# EAGLE design working (EAGLE 6.5.0)
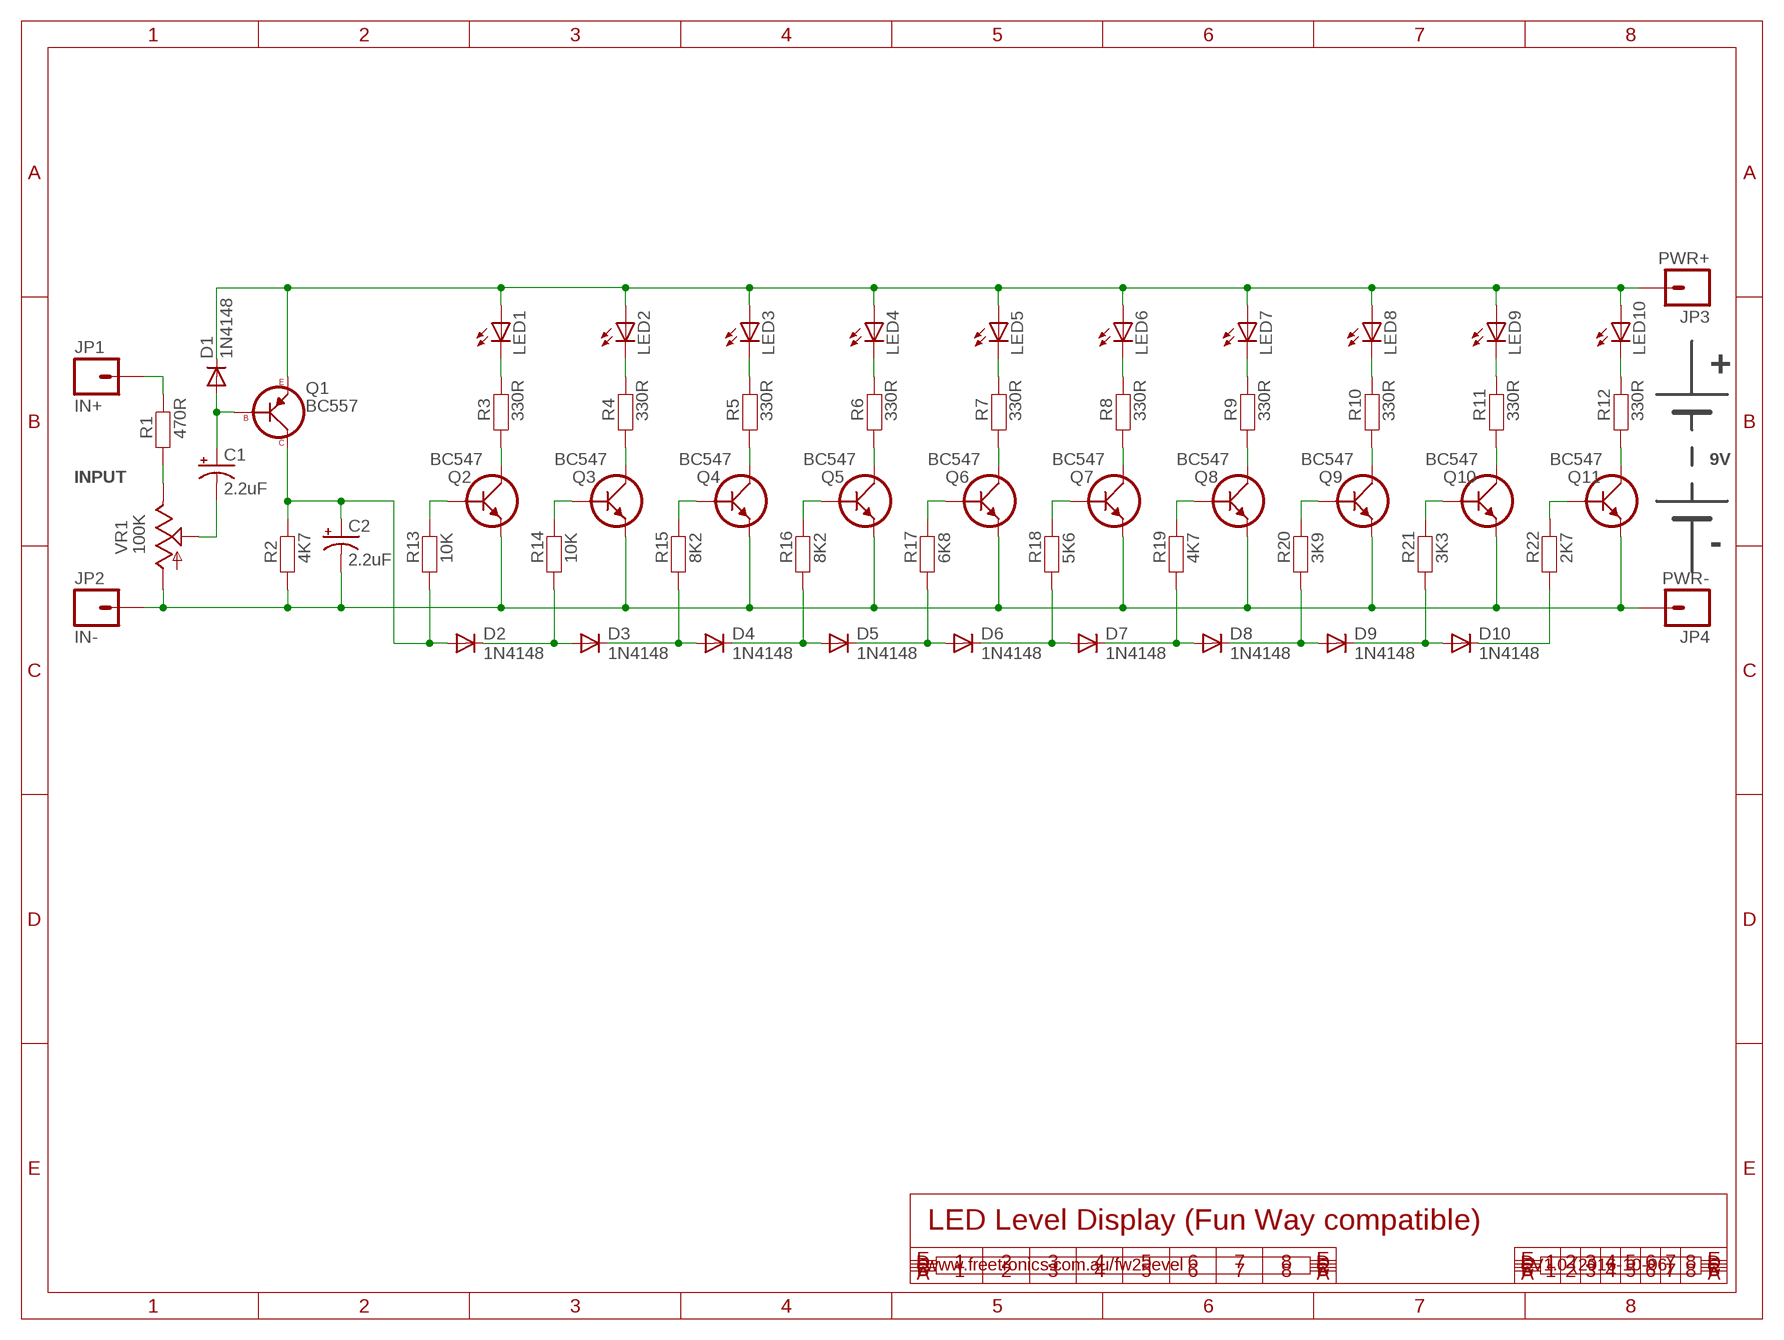
[diagram p0: schematic, sheet 1]

## Parts
C1  2.2uF  CAP_POLPTH1  [CPOL-RADIAL-100UF-25V]
C2  2.2uF  CAP_POLPTH1  [CPOL-RADIAL-100UF-25V]
D1  1N4148  DIODE1N914L  [DIODE-1N914L]
D2  1N4148  DIODE1N914L  [DIODE-1N914L]
D3  1N4148  DIODE1N914L  [DIODE-1N914L]
D4  1N4148  DIODE1N914L  [DIODE-1N914L]
D5  1N4148  DIODE1N914L  [DIODE-1N914L]
D6  1N4148  DIODE1N914L  [DIODE-1N914L]
D7  1N4148  DIODE1N914L  [DIODE-1N914L]
D8  1N4148  DIODE1N914L  [DIODE-1N914L]
D9  1N4148  DIODE1N914L  [DIODE-1N914L]
D10  1N4148  DIODE1N914L  [DIODE-1N914L]
JP1  IN+  M01PTH  [1X01]
JP2  IN-  M01PTH  [1X01]
JP3  PWR+  M01PTH  [1X01]
JP4  PWR-  M01PTH  [1X01]
LED1  LED5MML  [LED5MMLARGE]
LED2  LED5MML  [LED5MMLARGE]
LED3  LED5MML  [LED5MMLARGE]
LED4  LED5MML  [LED5MMLARGE]
LED5  LED5MML  [LED5MMLARGE]
LED6  LED5MML  [LED5MMLARGE]
LED7  LED5MML  [LED5MMLARGE]
LED8  LED5MML  [LED5MMLARGE]
LED9  LED5MML  [LED5MMLARGE]
LED10  LED5MML  [LED5MMLARGE]
Q1  BC557  [TO-92]
Q2  BC547  [TO-92]
Q3  BC547  [TO-92]
Q4  BC547  [TO-92]
Q5  BC547  [TO-92]
Q6  BC547  [TO-92]
Q7  BC547  [TO-92]
Q8  BC547  [TO-92]
Q9  BC547  [TO-92]
Q10  BC547  [TO-92]
Q11  BC547  [TO-92]
R1  470R  FREETRONICS_RESISTORPTH3  [AXIAL-0.4-LARGE]
R2  4K7  FREETRONICS_RESISTORPTH3  [AXIAL-0.4-LARGE]
R3  330R  RESISTORVERT3  [0309VW]
R4  330R  RESISTORVERT3  [0309VW]
R5  330R  RESISTORVERT3  [0309VW]
R6  330R  RESISTORVERT3  [0309VW]
R7  330R  RESISTORVERT3  [0309VW]
R8  330R  RESISTORVERT3  [0309VW]
R9  330R  RESISTORVERT3  [0309VW]
R10  330R  RESISTORVERT3  [0309VW]
R11  330R  RESISTORVERT3  [0309VW]
R12  330R  RESISTORVERT3  [0309VW]
R13  10K  RESISTORVERT3  [0309VW]
R14  10K  RESISTORVERT3  [0309VW]
R15  8K2  RESISTORVERT3  [0309VW]
R16  8K2  RESISTORVERT3  [0309VW]
R17  6K8  RESISTORVERT3  [0309VW]
R18  5K6  RESISTORVERT3  [0309VW]
R19  4K7  RESISTORVERT3  [0309VW]
R20  3K9  RESISTORVERT3  [0309VW]
R21  3K3  RESISTORVERT3  [0309VW]
R22  2K7  RESISTORVERT3  [0309VW]
VR1  100K  TRIM  [6MM]

## Nets
N$1: D10.C R22.1
N$2: Q2.2(B) R13.2
N$3: Q2.1(C) R3.2
N$4: LED1.K(C) R3.1
N$5: Q11.2(B) R22.2
N$6: D1.C JP3.1 LED1.A LED2.A LED3.A LED4.A LED5.A LED6.A LED7.A LED8.A LED9.A LED10.A Q1.3(E)
N$7: Q3.1(C) R4.2
N$8: LED2.K(C) R4.1
N$9: Q4.1(C) R5.2
N$10: D6.C D7.A R18.1
N$11: LED3.K(C) R5.1
N$12: Q3.2(B) R14.2
N$13: C2.1(+) D2.A Q1.1(C) R2.P$2 R13.1
N$14: D2.C D3.A R14.1
N$15: C2.2(-) JP2.1 JP4.1 Q2.3(E) Q3.3(E) Q4.3(E) Q5.3(E) Q6.3(E) Q7.3(E) Q8.3(E) Q9.3(E) Q10.3(E) Q11.3(E) R2.P$1 VR1.A
N$16: Q5.1(C) R6.2
N$17: LED4.K(C) R6.1
N$18: Q6.1(C) R7.2
N$19: LED5.K(C) R7.1
N$20: Q7.1(C) R8.2
N$21: LED6.K(C) R8.1
N$22: Q4.2(B) R15.2
N$23: Q5.2(B) R16.2
N$24: Q6.2(B) R17.2
N$25: D5.C D6.A R17.1
N$26: D4.C D5.A R16.1
N$27: D3.C D4.A R15.1
N$28: D7.C D8.A R19.1
N$29: D8.C D9.A R20.1
N$30: D9.C D10.A R21.1
N$31: Q7.2(B) R18.2
N$32: Q8.2(B) R19.2
N$33: Q9.2(B) R20.2
N$34: Q10.2(B) R21.2
N$35: Q8.1(C) R9.2
N$36: LED7.K(C) R9.1
N$37: Q9.1(C) R10.2
N$38: LED8.K(C) R10.1
N$39: Q10.1(C) R11.2
N$40: LED9.K(C) R11.1
N$41: Q11.1(C) R12.2
N$42: LED10.K(C) R12.1
N$43: C1.1(+) D1.A Q1.2(B)
N$45: C1.2(-) VR1.S
N$46: R1.P$1 VR1.E
N$47: JP1.1 R1.P$2

## Notes on the sheet
- +
- 9V
- INPUT
- -
- LED Level Display (Fun Way compatible)
- www.freetronics.com.au/fw2-level | V1.0 (2016-10-06)

## Library data of the parts
C1 C2 = SparkFun:CAP_POL: Capacitor Polarized These are standard SMD and PTH capacitors. Normally 10uF, 47uF, and 100uF in electrolytic and tantalum varieties. Always verify the external diameter of the through hole cap, it varies with capacity, voltage, and manufacturer. The EIA devices should be standard.
D1-D10 = freetronics-master-v1.1:DIODE: Diode These are standard reverse protection diodes and small signal diodes. SMA package can handle up to about 1A. SOD-323 can handle about 200mA. What the SOD-323 package when ordering, there are some mfgs out there that are 5-pin packages.
JP1-JP4 = freetronics-master-v1.1:M01: Header 1 Standard 1-pin 0.1" header. Use with straight break away headers (SKU : PRT-00116), right angle break away headers (PRT-00553), swiss pins (PRT-00743), machine pins (PRT-00117), and female headers (PRT-00115).
LED1-LED10 = freetronics-master-v1.1:LED: LEDs Standard schematic elements and footprints for 5mm, 3mm, 1206, and 0603 sized LEDs. 5mm - Spark Fun Electronics SKU : COM-00529 (and others)
Q1 = freetronics-master-v1.1:BC557
Q2-Q11 = freetronics-master-v1.1:BC547
R1 R2 = freetronics:FREETRONICS_RESISTOR: Resistor Basic schematic elements and footprints for 0603, 1206, and PTH 1/10th watt (small) resistors.
R3-R22 = freetronics-jon:RESISTOR: Resistor Basic schematic elements and footprints for 0603, 1206, and PTH 1/10th watt (small) resistors.
VR1 = adafruit:TRIM

## Board
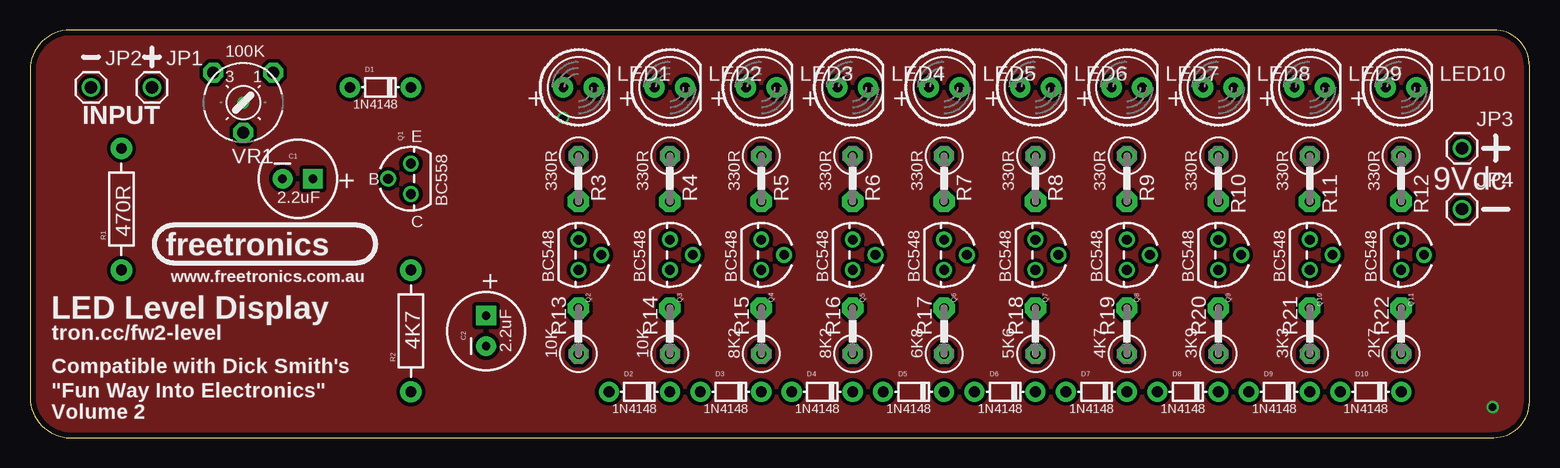
[diagram p1: board, top side]
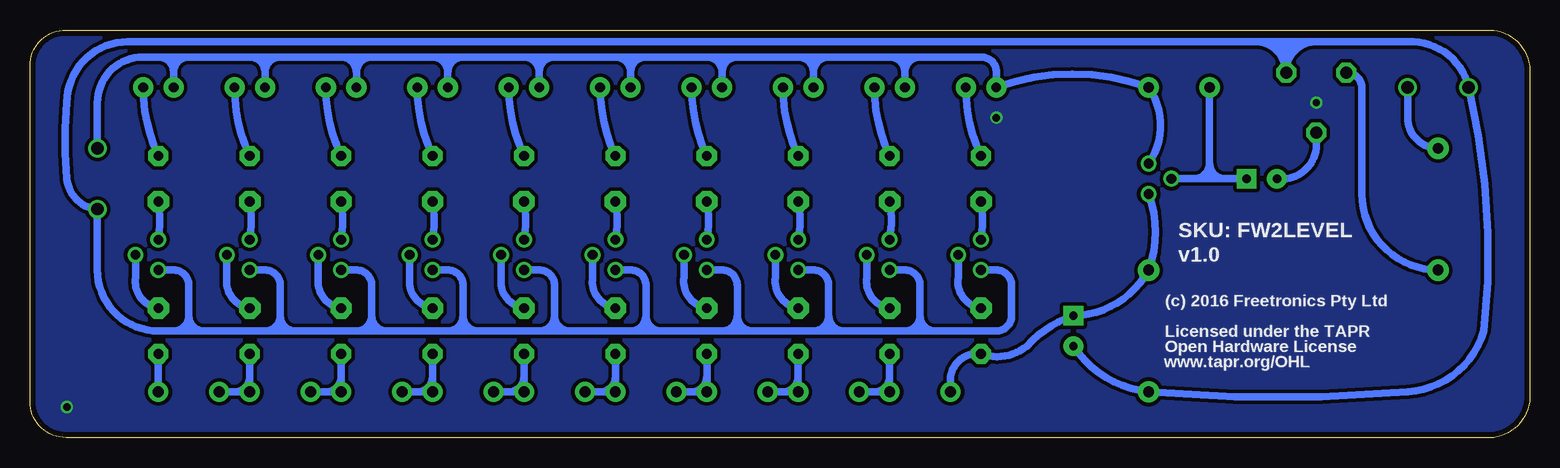
[diagram p2: board, bottom side, seen from below]

Size 125 x 34 mm. Coordinates in mm from the lower left corner, seen from the top.
Outline: 0,3 arc74 3,0 122,0 arc90 125,3 125,31 arc90 122,34 3,34 arc74 0,31 0,3
Copper layers (1*16): Top 0.035mm / dielectric 1.5mm / Bottom 0.035mm
Design rules "default *": minimum track width 10mil, minimum drill 24mil, track to track 12mil, track to pad 12mil, pad to pad 12mil, via to via 12mil, smd to smd 8mil, copper to edge 18mil, drill to drill 8mil, minimum pad ring 10mil, minimum via ring 8mil, stop-mask expansion 4mil, vias tented up to drill 25mil, thermal gap 10mil

### Footprints (pad centres in the part's own frame; a part is rotated, then mirrored left to right if it is on the bottom)
CPOL-RADIAL-100UF-25V = drill 0.7 pad 1.651 square: 1 1.27,0 | drill 0.7 pad 1.651: 2 -1.27,0
DIODE-1N914L = drill 0.9 pad 1.676: A -2.54,0; C 2.54,0
1X01 = drill 1.016: 1 0,0
LED5MMLARGE = drill 0.813 pad 1.676: A -1.27,0; K 1.27,0
TO-92 = drill 0.813: 1 -1.27,0; 2 0,1.905; 3 1.27,0
AXIAL-0.4-LARGE = drill 0.9 pad 1.778: P$1 -5.08,0; P$2 5.08,0
0309VW = drill 0.813 pad 1.676 octagon: 1 -1.905,0 | drill 0.813 pad 1.778 octagon: 2 1.905,0
6MM = drill 1 pad 1.676 octagon: A -2.5,-2.5; E 2.5,-2.5; S 0,2.5

### Placement (x,y rotation side)
C1  22.32,21.59 0 top
C2  38.02,8.89 90 top
D1  29.21,29.21 0 top
D2  50.8,3.81 0 top
D3  58.42,3.81 0 top
D4  66.04,3.81 0 top
D5  73.66,3.81 0 top
D6  81.28,3.81 0 top
D7  88.9,3.81 0 top
D8  96.52,3.81 0 top
D9  104.14,3.81 0 top
D10  111.76,3.81 0 top
JP1  10.16,29.21 0 top
JP2  5.08,29.21 0 top
JP3  119.38,24.13 0 top
JP4  119.38,19.05 0 top
LED1  45.72,29.21 0 top
LED2  53.34,29.21 0 top
LED3  60.96,29.21 0 top
LED4  68.58,29.21 0 top
LED5  76.2,29.21 0 top
LED6  83.82,29.21 0 top
LED7  91.44,29.21 0 top
LED8  99.06,29.21 0 top
LED9  106.68,29.21 0 top
LED10  114.3,29.21 0 top
Q1  31.75,21.59 90 top
Q2  45.72,15.24 270 top
Q3  53.34,15.24 270 top
Q4  60.96,15.24 270 top
Q5  68.58,15.24 270 top
Q6  76.2,15.24 270 top
Q7  83.82,15.24 270 top
Q8  91.44,15.24 270 top
Q9  99.06,15.24 270 top
Q10  106.68,15.24 270 top
Q11  114.3,15.24 270 top
R1  7.62,19.05 90 top
R2  31.75,8.89 90 top
R3  45.72,21.59 270 top
R4  53.34,21.59 270 top
R5  60.96,21.59 270 top
R6  68.58,21.59 270 top
R7  76.2,21.59 270 top
R8  83.82,21.59 270 top
R9  91.44,21.59 270 top
R10  99.06,21.59 270 top
R11  106.68,21.59 270 top
R12  114.3,21.59 270 top
R13  45.72,8.89 90 top
R14  53.34,8.89 90 top
R15  60.96,8.89 90 top
R16  68.58,8.89 90 top
R17  76.2,8.89 90 top
R18  83.82,8.89 90 top
R19  91.44,8.89 90 top
R20  99.06,8.89 90 top
R21  106.68,8.89 90 top
R22  114.3,8.89 90 top
VR1  17.78,27.94 180 top

### Tracks (layer width: path | path; a pad name or v marks a point on that pad's centre or on a via)
GND  (via drill 0.6)
  other vias: 44.45,26.67 17.78,27.94 121.92,2.54
  pour Bottom: 0,31 arc-74 3,34 122,34 arc-74 125,31 125,3 arc-74 122,0 3,0 arc-74 0,3
  pour Top: 0,31 arc-74 3,34 122,34 arc-74 125,31 125,3 arc-74 122,0 3,0 arc-74 0,3
N$1
  Bottom 0.61: R22.1 D10.C
N$2
  Bottom 0.61: Q2.2 47.62,13.34 arc-90 R13.2
N$3
  Bottom 0.61: R3.2 arc20 Q2.1
N$4
  Bottom 0.61: R3.1 arc25 LED1.K
N$5
  Bottom 0.61: Q11.2 116.2,13.34 arc-90 R22.2
N$6
  Bottom 0.61: LED2.A 52.07,30.48 | 52.07,30.48 arc90 50.8,31.75 | 50.8,31.75 45.72,31.75 arc90 44.45,30.48 LED1.A arc40 D1.C arc70 Q1.3 | LED10.A 113.03,30.48 | 113.03,30.48 arc90 111.76,31.75 106.68,31.75 arc90 105.41,30.48 | 105.41,30.48 LED9.A | LED8.A 97.79,30.48 | 97.79,30.48 arc-90 99.06,31.75 104.14,31.75 arc-90 105.41,30.48 | LED7.A 90.17,30.48 | 90.17,30.48 arc-90 91.44,31.75 96.52,31.75 arc-90 97.79,30.48 | LED6.A 82.55,30.48 | 82.55,30.48 arc-90 83.82,31.75 88.9,31.75 arc-90 90.17,30.48 | LED5.A 74.93,30.48 | 74.93,30.48 arc-90 76.2,31.75 81.28,31.75 arc-90 82.55,30.48 | LED4.A 67.31,30.48 | 67.31,30.48 arc-90 68.58,31.75 73.66,31.75 arc-90 74.93,30.48 | LED3.A 59.69,30.48 | 59.69,30.48 arc-90 60.96,31.75 66.04,31.75 arc-90 67.31,30.48 | 52.07,30.48 arc-90 53.34,31.75 58.42,31.75 arc-90 59.69,30.48 | JP3.1 119.38,27.94 arc90 115.57,31.75 114.3,31.75 | 114.3,31.75 arc90 113.03,30.48 | 50.8,31.75 114.3,31.75
N$7
  Bottom 0.61: R4.2 arc20 Q3.1
N$8
  Bottom 0.61: R4.1 arc25 LED2.K
N$9
  Bottom 0.61: R5.2 arc20 Q4.1
N$10
  Bottom 0.61: R18.1 83.82,5.08 | 83.82,5.08 D6.C 85.09,3.81 | 85.09,3.81 D7.A | 83.82,5.08 arc90 85.09,3.81
N$11
  Bottom 0.61: R5.1 arc25 LED3.K
N$12
  Bottom 0.61: Q3.2 55.24,13.34 arc-90 R14.2
N$13
  Bottom 0.61: Q1.1 arc40 R2.P$2 arc60 C2.1 arc-30 41.91,7.62 arc60 R13.1 arc-90 48.26,5.08 D2.A
N$14
  Bottom 0.61: R14.1 53.34,5.08 | 53.34,5.08 D2.C 54.61,3.81 | 54.61,3.81 D3.A | 53.34,5.08 arc90 54.61,3.81
N$15
  Bottom 0.61: 50.8,10.16 50.8,12.7 arc-90 52.07,13.97 Q3.3 | 50.8,10.16 arc90 52.07,8.89 57.15,8.89 arc90 58.42,10.16 | 58.42,10.16 58.42,12.7 arc-90 59.69,13.97 Q4.3 | 58.42,10.16 arc90 59.69,8.89 64.77,8.89 arc90 66.04,10.16 | 66.04,10.16 66.04,12.7 arc-90 67.31,13.97 Q5.3 | 66.04,10.16 arc90 67.31,8.89 72.39,8.89 arc90 73.66,10.16 | 73.66,10.16 73.66,12.7 arc-90 74.93,13.97 Q6.3 | 73.66,10.16 arc90 74.93,8.89 80.01,8.89 arc90 81.28,10.16 | 81.28,10.16 81.28,12.7 arc-90 82.55,13.97 Q7.3 | 81.28,10.16 arc90 82.55,8.89 87.63,8.89 arc90 88.9,10.16 | 88.9,10.16 88.9,12.7 arc-90 90.17,13.97 Q8.3 | 88.9,10.16 arc90 90.17,8.89 95.25,8.89 arc90 96.52,10.16 | 96.52,10.16 96.52,12.7 arc-90 97.79,13.97 Q9.3 | 96.52,10.16 arc90 97.79,8.89 102.87,8.89 arc90 104.14,10.16 | 104.14,10.16 104.14,12.7 arc-90 105.41,13.97 Q10.3 | 50.8,10.16 arc-90 49.53,8.89 | 49.53,8.89 44.45,8.89 arc-90 43.18,10.16 43.18,12.7 arc-90 44.45,13.97 Q2.3 | 104.14,10.16 arc90 105.41,8.89 110.49,8.89 arc90 111.76,10.16 | 111.76,10.16 111.76,12.7 arc-90 113.03,13.97 Q11.3 | 21.59,33.02 20.32,33.02 | 20.32,33.02 19.05,33.02 | 19.05,33.02 17.78,33.02 | 17.78,33.02 10.16,33.02 arc80 JP2.1 arc20 3.81,8.89 arc70 10.16,3.81 arc10 R2.P$1 arc50 C2.2 | 21.59,33.02 22.86,33.02 | 113.03,8.89 114.3,8.89 arc90 119.38,13.97 JP4.1 arc80 121.92,21.59 arc10 121.92,27.94 arc90 116.84,33.02 24.13,33.02 22.86,33.02 | 113.03,8.89 arc-90 111.76,10.16 | 21.59,33.02 arc90 20.28,31.71 VR1.A | 49.53,8.89 113.03,8.89 | 19.05,33.02 arc-90 20.32,31.75 20.32,33.02 | 17.78,33.02 arc-90 20.32,30.48 arc-90 22.86,33.02
N$16
  Bottom 0.61: R6.2 arc20 Q5.1
N$17
  Bottom 0.61: R6.1 arc25 LED4.K
N$18
  Bottom 0.61: R7.2 arc20 Q6.1
N$19
  Bottom 0.61: R7.1 arc25 LED5.K
N$20
  Bottom 0.61: R8.2 arc20 Q7.1
N$21
  Bottom 0.61: R8.1 arc25 LED6.K
N$22
  Bottom 0.61: Q4.2 62.87,13.34 arc-90 R15.2
N$23
  Bottom 0.61: Q5.2 70.48,13.34 arc-90 R16.2
N$24
  Bottom 0.61: Q6.2 78.11,13.34 arc-90 R17.2
N$25
  Bottom 0.61: R17.1 76.2,5.08 | 76.2,5.08 D5.C 77.47,3.81 | 77.47,3.81 D6.A | 76.2,5.08 arc90 77.47,3.81
N$26
  Bottom 0.61: R16.1 68.58,5.08 | 68.58,5.08 D4.C 69.85,3.81 | 69.85,3.81 D5.A | 68.58,5.08 arc90 69.85,3.81
N$27
  Bottom 0.61: R15.1 60.96,5.08 | 60.96,5.08 D3.C 62.23,3.81 | 62.23,3.81 D4.A | 60.96,5.08 arc90 62.23,3.81
N$28
  Bottom 0.61: R19.1 91.44,5.08 | 91.44,5.08 D7.C 92.71,3.81 | 92.71,3.81 D8.A | 91.44,5.08 arc90 92.71,3.81
N$29
  Bottom 0.61: R20.1 99.06,5.08 | 99.06,5.08 D8.C 100.33,3.81 | 100.33,3.81 D9.A | 99.06,5.08 arc90 100.33,3.81
N$30
  Bottom 0.61: R21.1 106.68,5.08 | 106.68,5.08 D9.C 107.95,3.81 | 107.95,3.81 D10.A | 106.68,5.08 arc90 107.95,3.81
N$31
  Bottom 0.61: Q7.2 85.72,13.34 arc-90 R18.2
N$32
  Bottom 0.61: Q8.2 93.34,13.34 arc-90 R19.2
N$33
  Bottom 0.61: Q9.2 100.97,13.34 arc-90 R20.2
N$34
  Bottom 0.61: Q10.2 108.58,13.34 arc-90 R21.2
N$35
  Bottom 0.61: R9.2 arc20 Q8.1
N$36
  Bottom 0.61: R9.1 arc25 LED7.K
N$37
  Bottom 0.61: R10.2 arc20 Q9.1
N$38
  Bottom 0.61: R10.1 arc25 LED8.K
N$39
  Bottom 0.61: R11.2 arc20 Q10.1
N$40
  Bottom 0.61: R11.1 arc25 LED9.K
N$41
  Bottom 0.61: R12.2 arc20 Q11.1
N$42
  Bottom 0.61: R12.1 arc25 LED10.K
N$43
  Bottom 0.61: Q1.2 27.94,21.59 | D1.A 26.67,22.86 | 26.67,22.86 arc90 27.94,21.59 | C1.1 25.4,21.59 | 25.4,21.59 arc90 26.67,22.86 | 25.4,21.59 27.94,21.59
N$45
  Bottom 0.61: VR1.S 17.78,24.13 arc90 C1.2
N$46
  Bottom 0.61: R1.P$1 arc90 13.97,20.32 13.97,29.13 arc-90 VR1.E
N$47
  Bottom 0.61: JP1.1 10.16,26.67 arc-90 R1.P$2

### Text on the board
tPlace: 100K | + | + | + | + | + | + | + | + | + | + | INPUT | E | + | B | 330R | 330R | 330R | 330R | 330R | 330R | 330R | 330R | 330R | 330R | 9Vdc | 2.2uF | BC558 | C | freetronics | www.freetronics.com.au | BC548 | BC548 | BC548 | BC548 | BC548 | BC548 | BC548 | BC548 | BC548 | BC548 | + | LED Level Display | tron.cc/fw2-level | 2.2uF | 10K | 10K | 8K2 | 8K2 | 6K8 | 5K6 | 4K7 | 3K9 | 3K3 | 2K7 | Compatible with Dick Smith's | "Fun Way Into Electronics" | Volume 2
bPlace: SKU: FW2LEVEL | v1.0 | (c) 2016 Freetronics Pty Ltd | Licensed under the TAPR | Open Hardware License | www.tapr.org/OHL